# Altium schematic sheet CM5.SchDoc
size A3; Date: AUG 25; Engineer: NH; SheetNumber: 5; SheetTotal: 5
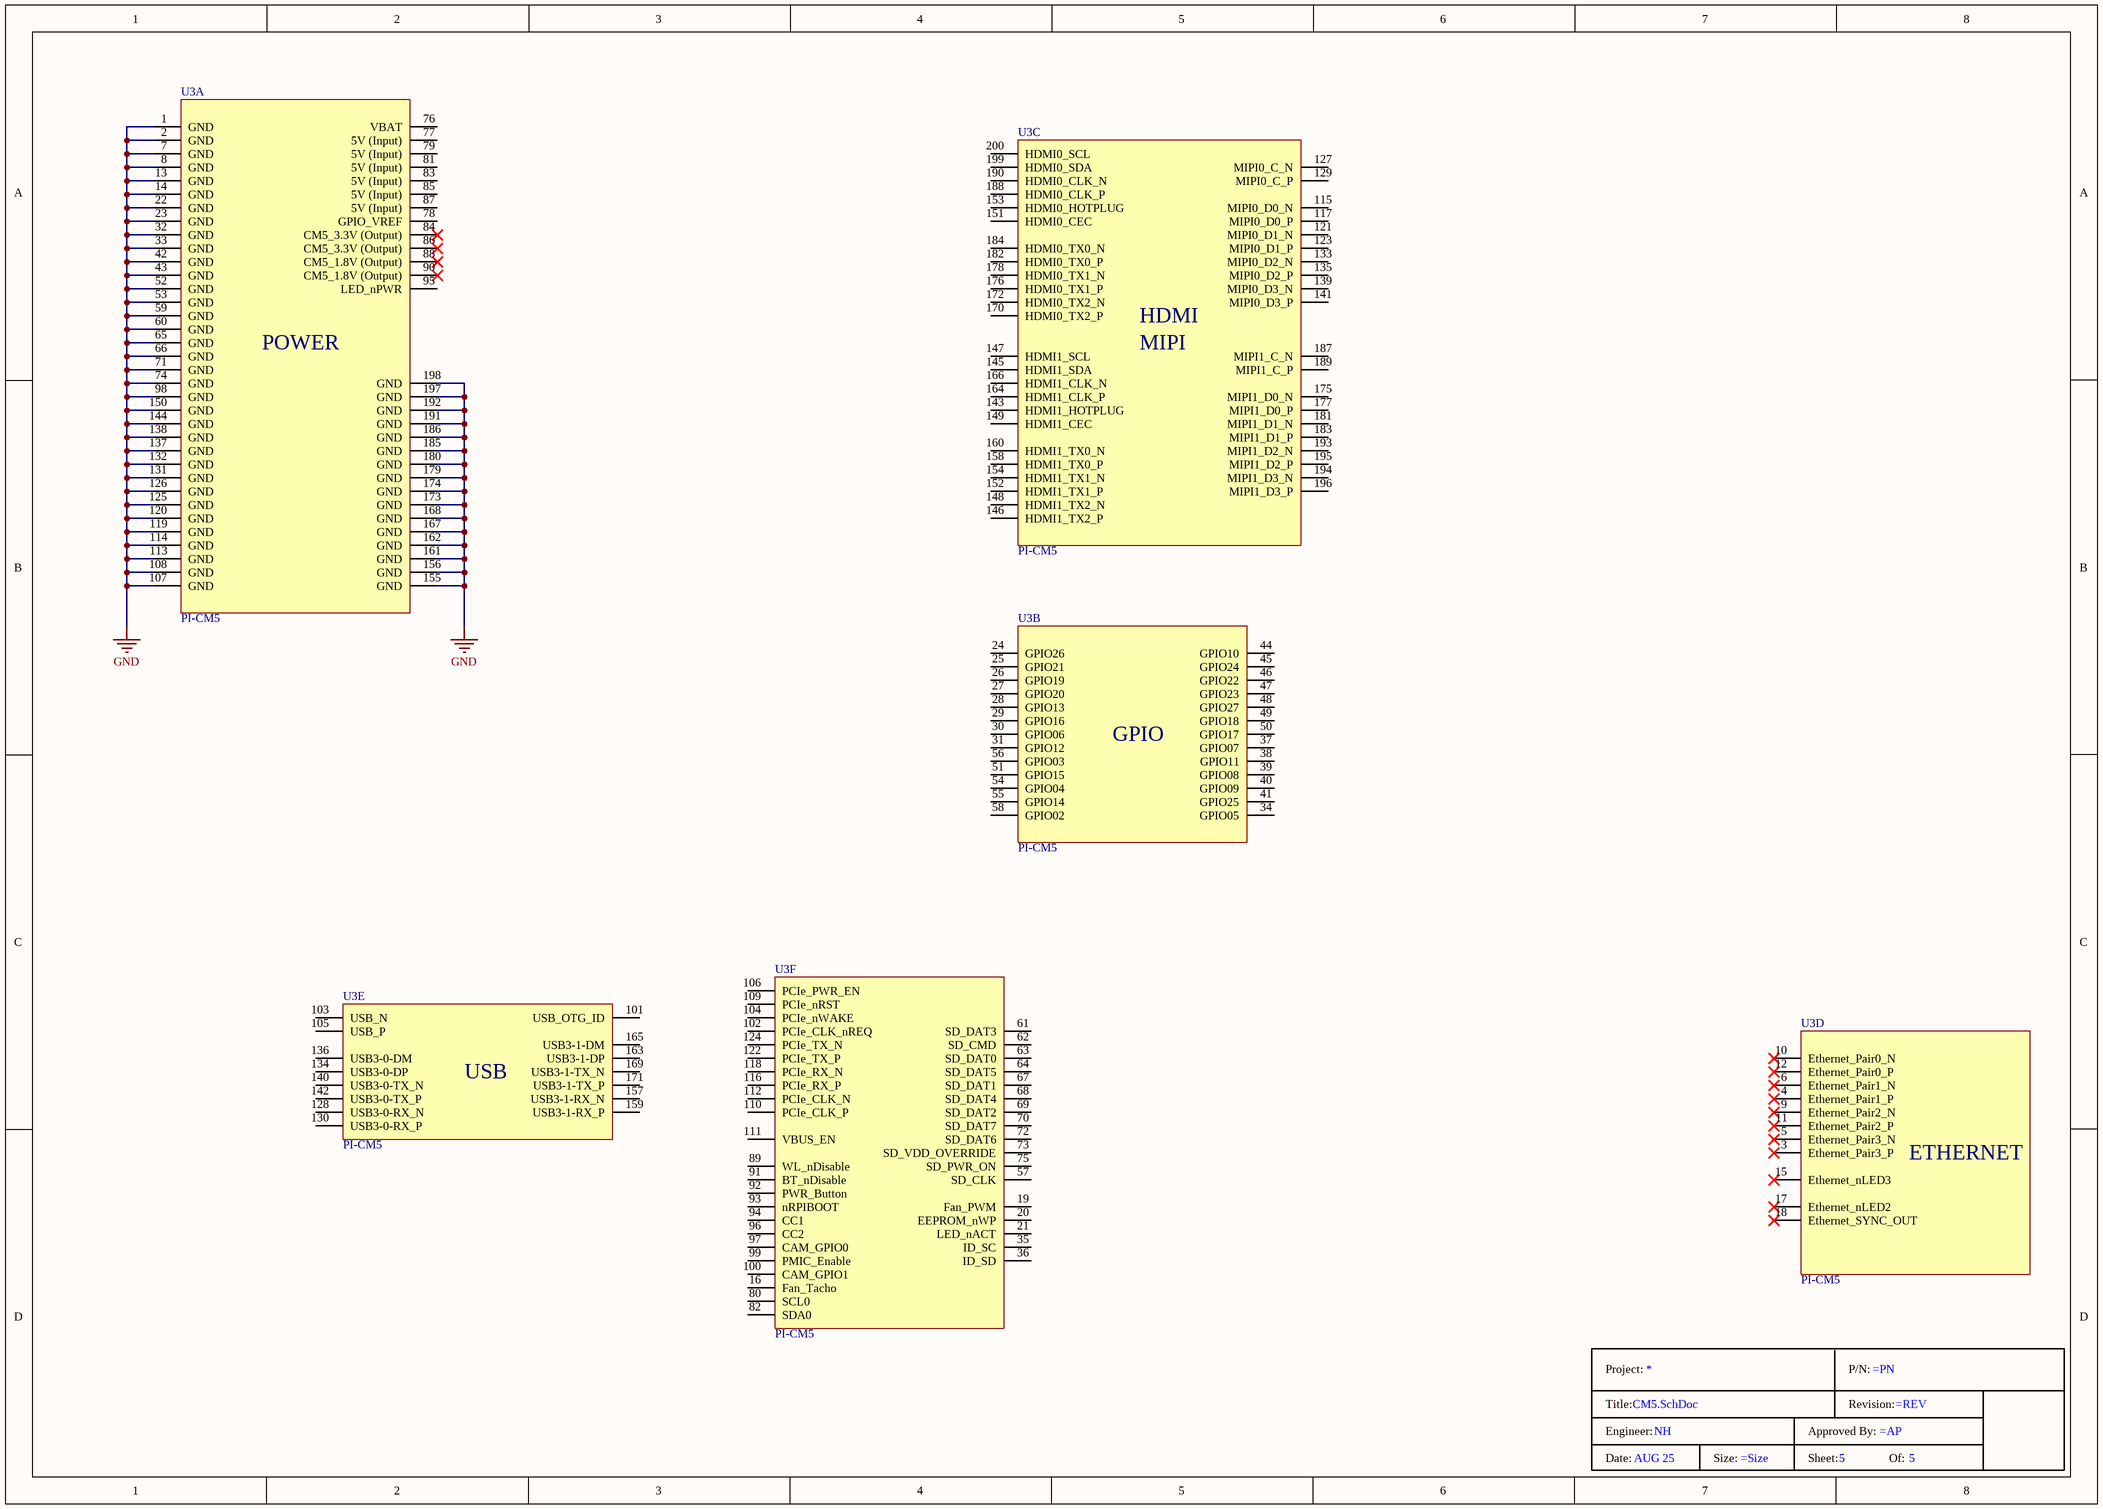
[diagram p0: CM5.SchDoc]

## Parts
*  Tital_block_1  (value not drawn)
U3  PI-CM5  [SC1562(PI-CM5)]  (parts A,B,C,D,E,F of 6)

## Nets
GND: U3.1(GND) U3.2(GND) U3.7(GND) U3.8(GND) U3.13(GND) U3.14(GND) U3.22(GND) U3.23(GND) U3.32(GND) U3.33(GND) U3.42(GND) U3.43(GND) U3.52(GND) U3.53(GND) U3.59(GND) U3.60(GND) U3.65(GND) U3.66(GND) U3.71(GND) U3.74(GND) U3.98(GND) U3.107(GND) U3.108(GND) U3.113(GND) U3.114(GND) U3.119(GND) U3.120(GND) U3.125(GND) U3.126(GND) U3.131(GND) U3.132(GND) U3.137(GND) U3.138(GND) U3.144(GND) U3.150(GND) U3.155(GND) U3.156(GND) U3.161(GND) U3.162(GND) U3.167(GND) U3.168(GND) U3.173(GND) U3.174(GND) U3.179(GND) U3.180(GND) U3.185(GND) U3.186(GND) U3.191(GND) U3.192(GND) U3.197(GND) U3.198(GND)

Not connected (* = marked no-connect by the designer): U3 3(Ethernet_Pair3_P)* 4(Ethernet_Pair1_P)* 5(Ethernet_Pair3_N)* 6(Ethernet_Pair1_N)* 9(Ethernet_Pair2_N)* 10(Ethernet_Pair0_N)* 11(Ethernet_Pair2_P)* 12(Ethernet_Pair0_P)* 15(Ethernet_nLED3)* 16(Fan_Tacho) 17(Ethernet_nLED2)* 18(Ethernet_SYNC_OUT)* 19(Fan_PWM) 20(EEPROM_nWP) 21(LED_nACT) 24(GPIO26) 25(GPIO21) 26(GPIO19) 27(GPIO20) 28(GPIO13) 29(GPIO16) 30(GPIO06) 31(GPIO12) 34(GPIO05) 35(ID_SC) 36(ID_SD) 37(GPIO07) 38(GPIO11) 39(GPIO08) 40(GPIO09) 41(GPIO25) 44(GPIO10) 45(GPIO24) 46(GPIO22) 47(GPIO23) 48(GPIO27) 49(GPIO18) 50(GPIO17) 51(GPIO15) 54(GPIO04) 55(GPIO14) 56(GPIO03) 57(SD_CLK) 58(GPIO02) 61(SD_DAT3) 62(SD_CMD) 63(SD_DAT0) 64(SD_DAT5) 67(SD_DAT1) 68(SD_DAT4) 69(SD_DAT2) 70(SD_DAT7) 72(SD_DAT6) 73(SD_VDD_OVERRIDE) 75(SD_PWR_ON) 76(VBAT) 77(5V_(Input)) 78(GPIO_VREF) 79(5V_(Input)) 80(SCL0) 81(5V_(Input)) 82(SDA0) 83(5V_(Input)) 84(CM5_3.3V_(Output))* 85(5V_(Input)) 86(CM5_3.3V_(Output))* 87(5V_(Input)) 88(CM5_1.8V_(Output))* 89(WL_nDisable) 90(CM5_1.8V_(Output))* 91(BT_nDisable) 92(PWR_Button) 93(nRPIBOOT) 94(CC1) 95(LED_nPWR) 96(CC2) 97(CAM_GPIO0) 99(PMIC_Enable) 100(CAM_GPIO1) 101(USB_OTG_ID) 102(PCIe_CLK_nREQ) 103(USB_N) 104(PCIe_nWAKE) 105(USB_P) 106(PCIe_PWR_EN) 109(PCIe_nRST) 110(PCIe_CLK_P) 111(VBUS_EN) 112(PCIe_CLK_N) 115(MIPI0_D0_N) 116(PCIe_RX_P) 117(MIPI0_D0_P) 118(PCIe_RX_N) 121(MIPI0_D1_N) 122(PCIe_TX_P) 123(MIPI0_D1_P) 124(PCIe_TX_N) 127(MIPI0_C_N) 128(USB3-0-RX_N) 129(MIPI0_C_P) 130(USB3-0-RX_P) 133(MIPI0_D2_N) 134(USB3-0-DP) 135(MIPI0_D2_P) 136(USB3-0-DM) 139(MIPI0_D3_N) 140(USB3-0-TX_N) 141(MIPI0_D3_P) 142(USB3-0-TX_P) 143(HDMI1_HOTPLUG) 145(HDMI1_SDA) 146(HDMI1_TX2_P) 147(HDMI1_SCL) 148(HDMI1_TX2_N) 149(HDMI1_CEC) 151(HDMI0_CEC) 152(HDMI1_TX1_P) 153(HDMI0_HOTPLUG) 154(HDMI1_TX1_N) 157(USB3-1-RX_N) 158(HDMI1_TX0_P) 159(USB3-1-RX_P) 160(HDMI1_TX0_N) 163(USB3-1-DP) 164(HDMI1_CLK_P) 165(USB3-1-DM) 166(HDMI1_CLK_N) 169(USB3-1-TX_N) 170(HDMI0_TX2_P) 171(USB3-1-TX_P) 172(HDMI0_TX2_N) 175(MIPI1_D0_N) 176(HDMI0_TX1_P) 177(MIPI1_D0_P) 178(HDMI0_TX1_N) 181(MIPI1_D1_N) 182(HDMI0_TX0_P) 183(MIPI1_D1_P) 184(HDMI0_TX0_N) 187(MIPI1_C_N) 188(HDMI0_CLK_P) 189(MIPI1_C_P) 190(HDMI0_CLK_N) 193(MIPI1_D2_N) 194(MIPI1_D3_N) 195(MIPI1_D2_P) 196(MIPI1_D3_P) 199(HDMI0_SDA) 200(HDMI0_SCL)

## Notes on the sheet
- (in symbol PI-CM5, part A) POWER
- (in symbol PI-CM5, part B) GPIO
- (in symbol PI-CM5, part C) HDMI; MIPI
- (in symbol PI-CM5, part D) ETHERNET
- (in symbol PI-CM5, part E) USB
- (in symbol Tital_block_1) Project:; P/N:; Title:; Revision:; Engineer:; Approved By:; Date:; Size:; Sheet:; Of: